# Altium schematic sheet IEPE_POWER.SchDoc
size A; SheetNumber: 7; SheetTotal: 7
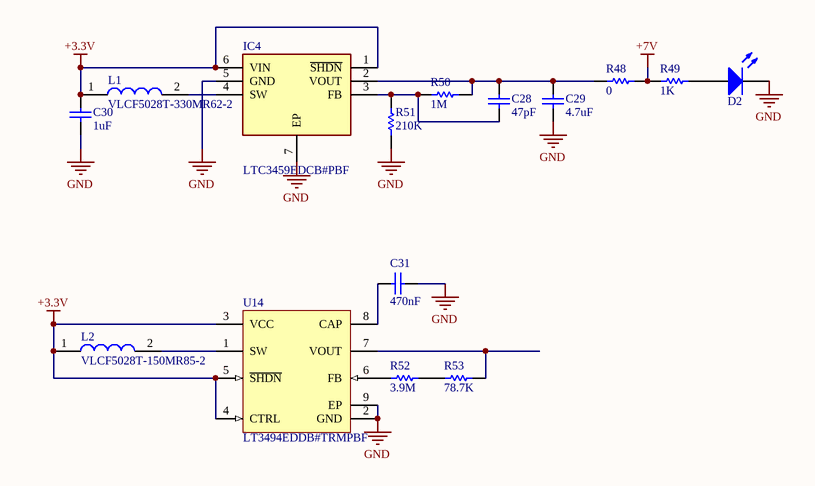
[diagram p0: IEPE_POWER.SchDoc]

## Parts
C28  47pF  [c603]
C29  4.7uF  [C805]
C30  1uF  [c603]
C31  470nF  [c603]
D2  LED  [led-0603]  (value not drawn)
IC4  LTC3459EDCB#PBF  [SON50P300X200X80-7N-D]
L1  VLCF5028T-330MR62-2  [VLCF5028]
L2  VLCF5028T-150MR85-2  [VLCF5028]
R48  0  [R0603]
R49  1K  [R0603]
R50  1M  [R0603]
R51  210K  [R0603]
R52  3.9M  [R0603]
R53  78.7K  [R0603]
U14  LT3494EDDB#TRMPBF  [LT-DDB-8_V]

## Nets
+3.3V: C30.2 IC4.1(~{SHDN}) IC4.6(VIN) L1.1 L2.1 U14.3(VCC) U14.4(CTRL) U14.5(~{SHDN})
+7V: R48.2 R49.1
GND: C29.1 C30.1 C31.1 D2.2(K) IC4.5(GND) IC4.7(EP) R51.1 U14.2(GND) U14.9(EP)
NetC28_1: C28.1 IC4.3(FB) R50.1 R51.2
NetC28_2: C28.2 C29.2 IC4.2(VOUT) R48.1 R50.2
NetC31_2: C31.2 U14.8(CAP)
NetD2_1: D2.1(A) R49.2
NetIC4_4: IC4.4(SW) L1.2
NetL2_2: L2.2 U14.1(SW)
NetR52_1: R52.1 U14.6(FB)
NetR52_2: R52.2 R53.1
NetR53_2: R53.2 U14.7(VOUT)

## Library data of the parts
C28-C31 = Cap: Capacitor; Designer: Parsa Malekpour
  C28: Value: 47pF
  C29: Value: 4.7uF
  C30: Value: 1uF
  C31: Value: 470nF
IC4 = LTC3459EDCB#PBF: Integrated Circuit; Manufacturer_Name: Analog Devices; Datasheet Link: https://eu.mouser.com/datasheet/2/609/3459fc-1268033.pdf; Height: 0.8mm; Manufacturer_Part_Number: LTC3459EDCB#PBF; Mouser Part Number: 584-LTC3459EDCB#PBF; Mouser Price/Stock: https://www.mouser.co.uk/ProductDetail/Analog-Devices/LTC3459EDCBPBF?qs=oahfZPh6IAJQ4v4AGuZiZA%3D%3D
L1 = VLCF5028T-330MR62-2: Inductor; Manufacturer_Name: TDK; Datasheet Link: https://product.tdk.com/system/files/dam/doc/product/inductor/inductor/smd/catalog/inductor_commercial_power_vlcf5028-2_en.pdf; Manufacturer_Part_Number: VLCF5028T-330MR62-2; Mouser Part Number: 810-VLCF528T330MR622; Mouser Price/Stock: https://www.mouser.co.uk/ProductDetail/TDK/VLCF5028T-330MR62-2?qs=uxmvvYJjMIsxJaGpQbGMMg%3D%3D
L2 = VLCF5028T-150MR85-2: Inductor; Manufacturer_Name: TDK; Datasheet Link: https://product.tdk.com/system/files/dam/doc/product/inductor/inductor/smd/catalog/inductor_commercial_power_vlcf5028-2_en.pdf; Manufacturer_Part_Number: VLCF5028T-150MR85-2; Mouser Part Number: 810-VLCF528T150MR852; Mouser Price/Stock: https://www.mouser.co.uk/ProductDetail/TDK/VLCF5028T-150MR85-2?qs=uxmvvYJjMIszC3VRfNbrqA%3D%3D; Arrow Part Number: VLCF5028T-150MR85-2; Arrow Price/Stock: https://www.arrow.com/en/products/vlcf5028t-150mr85-2/tdk?region=nac
R48-R53 = Resistor: Designer: Parsa Malekpour
  R48: Value: 0
  R49: Value: 1K
  R50: Value: 1M
  R51: Value: 210K
  R52: Value: 3.9M
  R53: Value: 78.7K
U14 = CMP-0491-00356-1: Micropower Low Noise Boost Converter with Output Disconnect, 8-pin SON (DDB-8), -40 to 85 degC, Pb-Free, Mini Tape and Reel; Manufacturer: Linear Technology; Number of Outputs: 1; ComponentLink1Description: Manufacturer URL; ComponentLink3URL: http://cds.linear.com/docs/en/packaging/DFN_8_05-08-1702.pdf; Code_JEDEC: MO-229; ComponentLink2URL: http://cds.linear.com/docs/en/datasheet/3494fb.pdf; PackageVersion: Rev. B, 06/2010; PackageReference: DDB-8; ComponentLink1URL: http://www.linear.com/; PartNumber: LT3494EDDB#TRMPBF; Packing: Mini Tape and Reel; PackageDescription: 8-Pin Plastic DFN, Body 3 x 2 mm, Pitch 0.5 mm; Mounting Technology: Surface Mount; RoHS: TRUE; ComponentLink3Description: Package Specification; ComponentLink2Description: Datasheet; DatasheetVersion: Rev. B